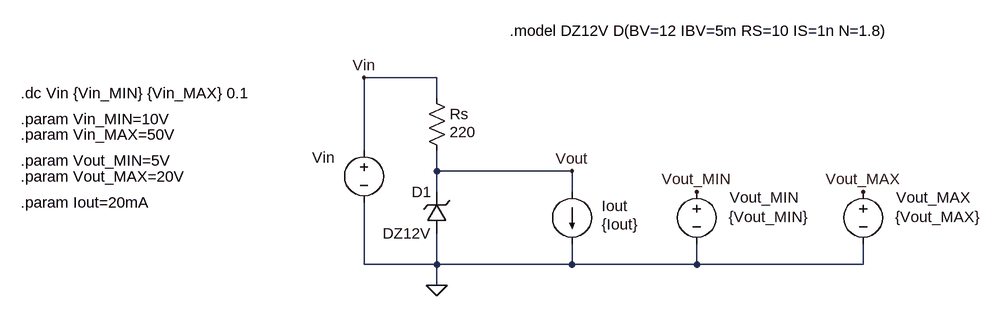
[diagram p0: schematic topology_B.asc]
topology_B.asc, the LTspice schematic file:
Version 4.1
SHEET 1 1664 680
WIRE 160 80 48 80
WIRE 160 112 160 80
WIRE 48 192 48 80
WIRE 160 224 160 192
WIRE 368 224 160 224
WIRE 160 256 160 224
WIRE 368 256 368 224
WIRE 48 368 48 272
WIRE 160 368 160 320
WIRE 160 368 48 368
WIRE 368 368 368 336
WIRE 368 368 160 368
WIRE 560 368 560 336
WIRE 560 368 368 368
WIRE 816 368 816 336
WIRE 816 368 560 368
WIRE 160 400 160 368
FLAG 48 80 Vin
FLAG 160 400 0
FLAG 368 224 Vout
FLAG 560 256 Vout_MIN
FLAG 816 256 Vout_MAX
SYMBOL res 144 96 R0
WINDOW 3 36 68 Left 2
SYMATTR InstName Rs
SYMATTR Value 220
SYMBOL voltage 48 176 R0
WINDOW 123 0 0 Left 0
WINDOW 39 0 0 Left 0
WINDOW 0 -80 27 Left 2
WINDOW 3 -82 66 Left 2
SYMATTR InstName Vin
SYMATTR Value ""
SYMBOL voltage 560 240 R0
WINDOW 123 0 0 Left 0
WINDOW 39 0 0 Left 0
WINDOW 0 51 25 Left 2
WINDOW 3 49 55 Left 2
SYMATTR InstName Vout_MIN
SYMATTR Value {Vout_MIN}
SYMBOL voltage 816 240 R0
WINDOW 123 0 0 Left 0
WINDOW 39 0 0 Left 0
WINDOW 0 51 25 Left 2
WINDOW 3 49 55 Left 2
SYMATTR InstName Vout_MAX
SYMATTR Value {Vout_MAX}
SYMBOL zener 176 320 R180
WINDOW 0 24 64 Left 2
WINDOW 3 24 0 Left 2
SYMATTR InstName D1
SYMATTR Value DZ12V
SYMBOL current 368 256 R0
WINDOW 0 46 22 Left 2
WINDOW 3 46 50 Left 2
WINDOW 123 0 0 Left 0
WINDOW 39 0 0 Left 0
SYMATTR InstName Iout
SYMATTR Value {Iout}
TEXT 272 8 Left 2 !.model DZ12V D(BV=12 IBV=5m RS=10 IS=1n N=1.8)
TEXT -480 104 Left 2 !.dc Vin {Vin_MIN} {Vin_MAX} 0.1
TEXT -480 144 Left 2 !.param Vin_MIN=10V
TEXT -480 168 Left 2 !.param Vin_MAX=50V
TEXT -480 208 Left 2 !.param Vout_MIN=5V
TEXT -480 232 Left 2 !.param Vout_MAX=20V
TEXT -480 272 Left 2 !.param Iout=20mA

The netlist it stands for:
* topology_B.asc
Rs Vin Vout 220
Vin Vin 0
Vout_MIN Vout_MIN 0 {Vout_MIN}
Vout_MAX Vout_MAX 0 {Vout_MAX}
D1 0 Vout DZ12V
Iout Vout 0 {Iout}
.model D D
.lib standard.dio
.model DZ12V D(BV=12 IBV=5m RS=10 IS=1n N=1.8)
.dc Vin {Vin_MIN} {Vin_MAX} 0.1
.param Vin_MIN=10V
.param Vin_MAX=50V
.param Vout_MIN=5V
.param Vout_MAX=20V
.param Iout=20mA
.backanno
.end